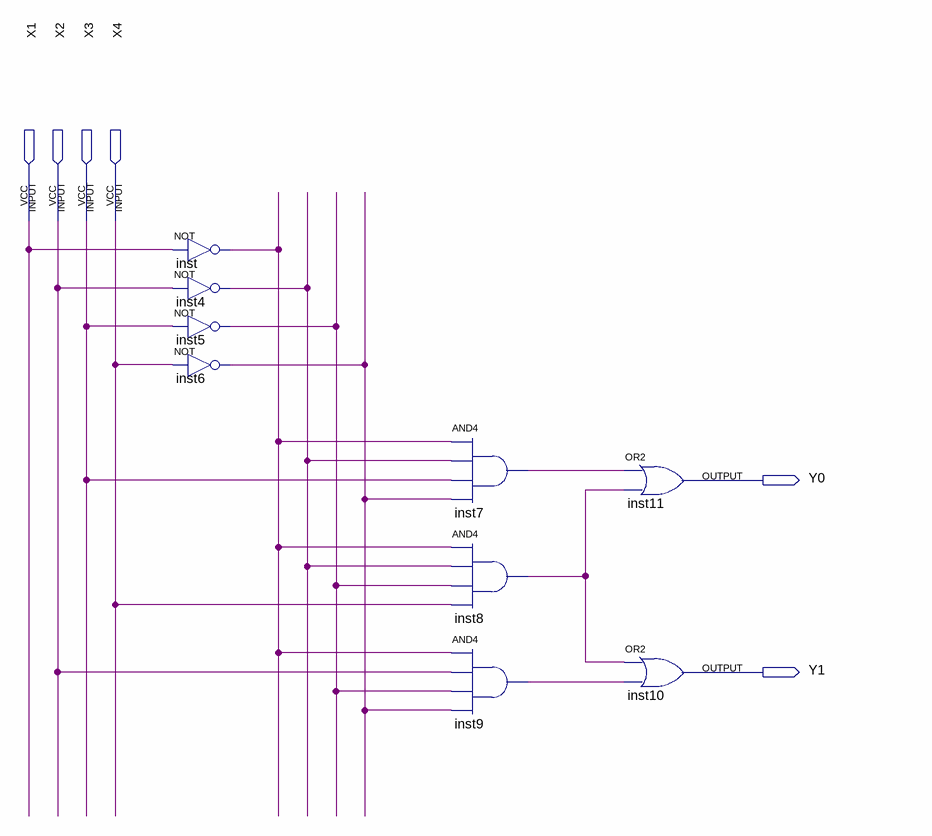
[diagram p0: schematic sheet]
// Quartus schematic 31.bdf as structural Verilog: 9 symbols, 6 pins
module \31  (
  input  X1,
  input  X2,
  input  X3,
  input  X4,
  output Y0,
  output Y1
);

  wire inst4_out, inst5_out, inst6_out, inst7_out, inst8_out, inst9_out, inst_out;

  not inst (inst_out, X1);
  not inst4 (inst4_out, X2);
  not inst5 (inst5_out, X3);
  not inst6 (inst6_out, X4);
  and inst7 (inst7_out, inst_out, inst4_out, X3, inst6_out);
  and inst8 (inst8_out, inst_out, inst4_out, inst5_out, X4);
  and inst9 (inst9_out, inst_out, X2, inst5_out, inst6_out);
  or inst11 (Y0, inst7_out, inst8_out);
  or inst10 (Y1, inst8_out, inst9_out);
endmodule
